# EAGLE design rbbb (EAGLE 6.4)
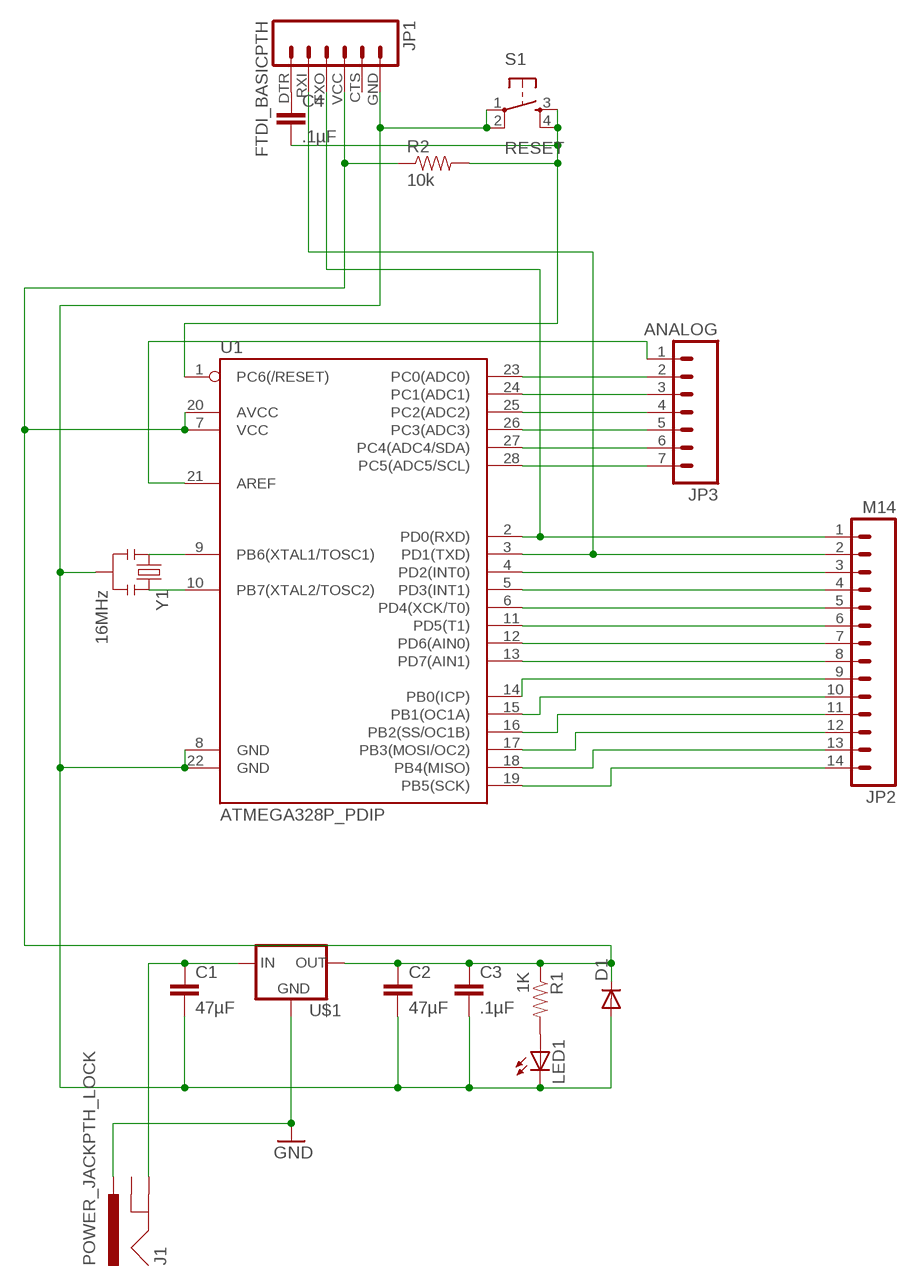
[diagram p0: schematic, sheet 1]

## Parts
C1  47µF  CAPPTH  [CAP-PTH-SMALL]
C2  47µF  CAPPTH  [CAP-PTH-SMALL]
C3  .1µF  CAPPTH  [CAP-PTH-SMALL]
C4  .1µF  CAPPTH  [CAP-PTH-SMALL]
D1  DIODEPTH  [DIODE-1N4001]
J1  POWER_JACKPTH_LOCK  [POWER_JACK_PTH_LOCK]
JP1  FTDI_BASICPTH  [FTDI_BASIC]
JP2  M14  [1X14]
JP3  ANALOG  M07  [1X07]
LED1  LED5MM  [LED5MM]
R1  1K  RESISTORPTH-1/4W  [AXIAL-0.4]
R2  10k  RESISTORPTH-1/4W  [AXIAL-0.4]
S1  RESET  TAC_SWITCHPTH  [TACTILE-PTH]
U1  ATMEGA328P_PDIP  [DIL28-3]
U$1  V_REG_78XX-TO-220  [TO-220-ALT]
Y1  16MHz  RESONATORPTH  [RESONATOR-PTH]

## Nets
GND: J1.PWR U$1.GND
N$1: U1.9(PB6(XTAL1/TOSC1)) Y1.1
N$2: U1.10(PB7(XTAL2/TOSC2)) Y1.3
N$3: LED1.A R1.P$2
N$4: C2.1 C3.1 D1.C JP1.VCC R1.P$1 R2.P$1 U1.7(VCC) U1.20(AVCC) U$1.OUT
N$5: C1.2 C2.2 C3.2 D1.A JP1.GND LED1.K(C) S1.1 S1.2 U1.8(GND) U1.22(GND) Y1.2
N$6: JP1.TXO JP2.1 U1.2(PD0(RXD))
N$7: C1.1 J1.GND U$1.IN
N$8: JP1.RXI JP2.2 U1.3(PD1(TXD))
N$9: JP2.3 U1.4(PD2(INT0))
N$10: C4.2 R2.P$2 S1.3 S1.4 U1.1(PC6(/RESET))
N$11: JP2.4 U1.5(PD3(INT1))
N$12: JP2.5 U1.6(PD4(XCK/T0))
N$13: C4.1 JP1.DTR
N$14: JP2.6 U1.11(PD5(T1))
N$15: JP2.7 U1.12(PD6(AIN0))
N$16: JP2.8 U1.13(PD7(AIN1))
N$17: JP2.9 U1.14(PB0(ICP))
N$18: JP2.10 U1.15(PB1(OC1A))
N$19: JP2.11 U1.16(PB2(SS/OC1B))
N$20: JP2.12 U1.17(PB3(MOSI/OC2))
N$21: JP2.13 U1.18(PB4(MISO))
N$22: JP2.14 U1.19(PB5(SCK))
N$23: JP3.1 U1.21(AREF)
N$24: JP3.2 U1.23(PC0(ADC0))
N$25: JP3.3 U1.24(PC1(ADC1))
N$26: JP3.4 U1.25(PC2(ADC2))
N$27: JP3.5 U1.26(PC3(ADC3))
N$28: JP3.6 U1.27(PC4(ADC4/SDA))
N$29: JP3.7 U1.28(PC5(ADC5/SCL))
Unconnected: J1.GNDBREAK JP1.CTS

## Library data of the parts
C1-C4 = SparkFun-Capacitors:CAP: Capacitor Standard 0603 ceramic capacitor, and 0.1" leaded capacitor.
D1 = SparkFun-DiscreteSemi:DIODE: Diode These are standard reverse protection diodes and small signal diodes. SMA package can handle up to about 1A. SOD-323 can handle about 200mA. What the SOD-323 package when ordering, there are some mfgs out there that are 5-pin packages.
J1 = SparkFun-Connectors:POWER_JACK: Power Jack This is the standard 5.5mm barrel jack for power. The PTH is the most common, proven, reliable, footprint. The Slot footprint only works if the mill layer is transmitted to the PCB fab house so be warned. Spark Fun Electronics SKU : PRT-00119 SMT: CONN-08106 Mating wall wart : TOL-00298 (and others)
JP1 = SparkFun-Connectors:FTDI_BASIC: FTDI Basic header with labels
JP2 = SparkFun-Connectors:M14: Header 14 Standard 14-pin 0.1" header. Use with straight break away headers (SKU : PRT-00116), right angle break away headers (PRT-00553), swiss pins (PRT-00743), machine pins (PRT-00117), and female headers (PRT-00115).
JP3 = SparkFun-Connectors:M07: Header 7 Standard 7-pin 0.1" header. Use with straight break away headers (SKU : PRT-00116), right angle break away headers (PRT-00553), swiss pins (PRT-00743), machine pins (PRT-00117), and female headers (PRT-00115). NOTES ON THE VARIANTS LOCK and LOCK_LONGPADS... This footprint was designed to help hold the alignment of a through-hole component (i.e. 7-pin header) while soldering it into place. You may notice that each hole has been shifted either up or down by 0.005 of an inch from it's more standard position (which is usually a perfectly straight line). This slight alteration caused the pins (the squares in the middle) to touch the edges of the holes. Because they are alternating, it causes a "brace" to hold the header in place. 0.005 has proven to be the perfect amount of "off-center" position when using our standard breakaway headers. Although looks a little odd when you look at the bare footprint, once you have a header in there, the alteration is very hard to notice. Also, if you push a header all the way into place, it is covered up entirely on the bottom side. This idea of altering the position of holes to aid alignment will be further integrated into the Sparkfun Library for other footprints. It can help hold any component with 3 or more connection pins.
LED1 = led:LED: LED OSRAM: - CHIPLED LG R971, LG N971, LY N971, LG Q971, LY Q971, LO R971, LY R971 LH N974, LH R974 LS Q976, LO Q976, LY Q976 LO Q996 - Hyper CHIPLED LW Q18S LB Q993, LB Q99A, LB R99A - SideLED LS A670, LO A670, LY A670, LG A670, LP A670 LB A673, LV A673, LT A673, LW A673 LH A674 LY A675 LS A676, LA A676, LO A676, LY A676, LW A676 LS A679, LY A679, LG A679 - Hyper Micro SIDELED® LS Y876, LA Y876, LO Y876, LY Y876 LT Y87S - SmartLED LW L88C, LW L88S LB L89C, LB L89S, LG L890 LS L89K, LO L89K, LY L89K LS L896, LA L896, LO L896, LY L896 - TOPLED LS T670, LO T670, LY T670, LG T670, LP T670 LSG T670, LSP T670, LSY T670, LOP T670, LYG T670 LG T671, LOG T671, LSG T671 LB T673, LV T673, LT T673, LW T673 LH T674 LS T676, LA T676, LO T676, LY T676, LB T676, LH T676, LSB T676, LW T676 LB T67C, LV T67C, LT T67C, LS T67K, LO T67K, LY T67K, LW E67C LS E67B, LA E67B, LO E67B, LY E67B, LB E67C, LV E67C, LT E67C LW T67C LS T679, LY T679, LG T679 LS T770, LO T770, LY T770, LG T770, LP T770 LB T773, LV T773, LT T773, LW T773 LH T774 LS E675, LA E675, LY E675, LS T675 LS T776, LA T776, LO T776, LY T776, LB T776 LHGB T686 LT T68C, LB T68C - Hyper Mini TOPLED® LB M676 - Mini TOPLED Santana® LG M470 LS M47K, LO M47K, LY M47K Source: http://www.osram.convergy.de LUXEON: - LUMILED® LXK2-PW12-R00, LXK2-PW12-S00, LXK2-PW14-U00, LXK2-PW14-V00 LXK2-PM12-R00, LXK2-PM12-S00, LXK2-PM14-U00 LXK2-PE12-Q00, LXK2-PE12-R00, LXK2-PE12-S00, LXK2-PE14-T00, LXK2-PE14-U00 LXK2-PB12-K00, LXK2-PB12-L00, LXK2-PB12-M00, LXK2-PB14-N00, LXK2-PB14-P00, LXK2-PB14-Q00 LXK2-PR12-L00, LXK2-PR12-M00, LXK2-PR14-Q00, LXK2-PR14-R00 LXK2-PD12-Q00, LXK2-PD12-R00, LXK2-PD12-S00 LXK2-PH12-R00, LXK2-PH12-S00 LXK2-PL12-P00, LXK2-PL12-Q00, LXK2-PL12-R00 Source: www.luxeon.com KINGBRIGHT: KA-3528ASYC Source: www.kingbright.com
R1 R2 = SparkFun-Resistors:RESISTOR: Resistor Basic schematic elements and footprints for 0603, 1206, and PTH resistors.
S1 = SparkFun-Electromechanical:TAC_SWITCH: Momentary Switch Button commonly used for reset or general input. Spark Fun Electronics SKU : COM-00097 SMT- SWCH-08247
U1 = SparkFun-DigitalIC:ATMEGA328P_PDIP: uC used in the Arduino 32kb flash, 1k EEPROM, 2k SRAM This is the through-hole version of this chip.
U$1 = SparkFun-PowerIC:V_REG_78XX: Voltage Regulator Standard 7805 5V regulator. IGO (Input Ground Output). Spark Fun Electronics SKU : COM-00107
Y1 = SparkFun-FreqCtrl:RESONATOR: Resonator Small SMD resonator. Used, eg, on the Arduino Pro/ Pro Mini boards. 8MHz- XTAL-08895 16MHz- XTAL-08900

## Board
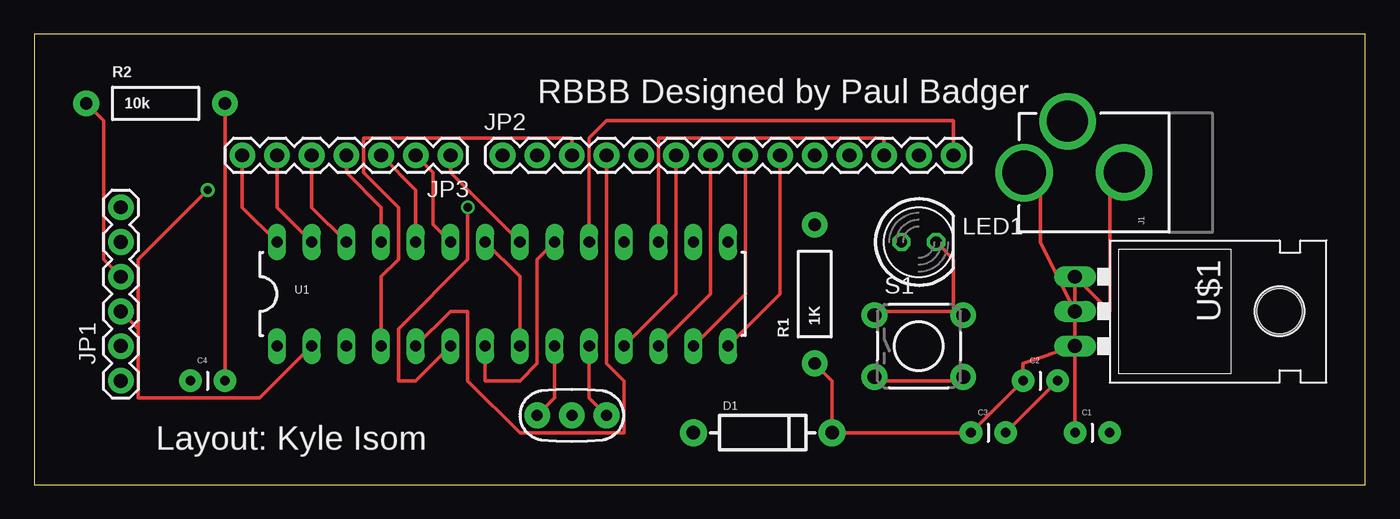
[diagram p1: board, top side]
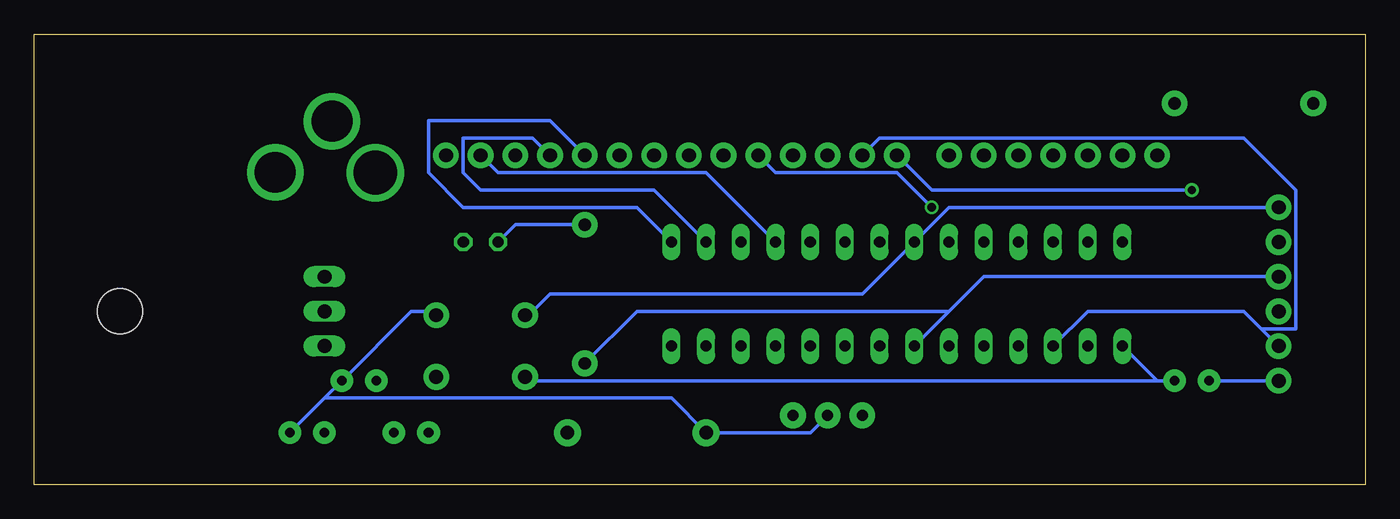
[diagram p2: board, bottom side, seen from below]

Size 97.46 x 33.01 mm. Coordinates in mm from the lower left corner, seen from the top.
Outline: 0,0 97.46,0 97.46,33.01 0,33.01 0,0
Copper layers (1*16): Top 0.035mm / dielectric 1.5mm / Bottom 0.035mm
Design rules "default": minimum track width 10mil, minimum drill 24mil, track to track 8mil, track to pad 8mil, pad to pad 8mil, via to via 8mil, smd to smd 8mil, copper to edge 40mil, drill to drill 8mil, minimum pad ring 10mil, minimum via ring 8mil, stop-mask expansion 4mil, vias tented up to drill 0mil, thermal gap 10mil

### Footprints (pad centres in the part's own frame; a part is rotated, then mirrored left to right if it is on the bottom)
CAP-PTH-SMALL = drill 0.7 pad 1.651: 1 0,0; 2 2.54,0
DIODE-1N4001 = drill 1 pad 1.981: A -5.08,0; C 5.08,0
POWER_JACK_PTH_LOCK = drill 2.997 pad 4.115: GND 0.025,6.557; GNDBREAK 3.762,10.7 | drill 3.2 pad 4.115: PWR 0,13.878
FTDI_BASIC = drill 1.016 pad 1.88: CTS 10.16,0; DTR 0,0; GND 12.7,0; RXI 2.54,0; TXO 5.08,0; VCC 7.62,0
1X14 = drill 1.016 pad 1.88: 1 0,0; 2 2.54,0; 3 5.08,0; 4 7.62,0; 5 10.16,0; 6 12.7,0; 7 15.24,0; 8 17.78,0; 9 20.32,0; 10 22.86,0; 11 25.4,0; 12 27.94,0; 13 30.48,0; 14 33.02,0
1X07 = drill 1.016 pad 1.88: 1 0,0; 2 2.54,0; 3 5.08,0; 4 7.62,0; 5 10.16,0; 6 12.7,0; 7 15.24,0
LED5MM = drill 0.813 octagon: A -1.27,0; K 1.27,0
AXIAL-0.4 = drill 0.9 pad 1.88: P$1 -5.08,0; P$2 5.08,0
TACTILE-PTH = drill 1.016 pad 1.88: 1 -3.251,2.261; 2 3.251,2.261; 3 -3.251,-2.261; 4 3.251,-2.261
DIL28-3 = drill 0.813 long: 1 -16.51,-3.81; 2 -13.97,-3.81; 3 -11.43,-3.81; 4 -8.89,-3.81; 5 -6.35,-3.81; 6 -3.81,-3.81; 7 -1.27,-3.81; 8 1.27,-3.81; 9 3.81,-3.81; 10 6.35,-3.81; 11 8.89,-3.81; 12 11.43,-3.81; 13 13.97,-3.81; 14 16.51,-3.81; 15 16.51,3.81; 16 13.97,3.81; 17 11.43,3.81; 18 8.89,3.81; 19 6.35,3.81; 20 3.81,3.81; 21 1.27,3.81; 22 -1.27,3.81; 23 -3.81,3.81; 24 -6.35,3.81; 25 -8.89,3.81; 26 -11.43,3.81; 27 -13.97,3.81; 28 -16.51,3.81
TO-220-ALT = drill 1.016 long: GND 0,-3.81; IN -2.54,-3.81; OUT 2.54,-3.81 | hole 3.302: 0,11.176
RESONATOR-PTH = drill 0.8 pad 1.88: 1 -2.54,0; 2 0,0; 3 2.54,0

### Placement (x,y rotation side)
C1  76.2,3.81 0 top
C2  72.39,7.62 0 top
C3  68.58,3.81 0 top
C4  11.43,7.62 0 top
D1  53.34,3.81 0 top
J1  86.36,22.86 90 top
JP1  6.35,7.62 90 top
JP2  34.29,24.13 0 top
JP3  30.48,24.13 180 top
LED1  64.77,17.78 0 top
R1  57.15,13.97 90 top
R2  8.89,27.94 0 top
S1  64.77,10.16 0 top
U1  34.29,13.97 0 top
U$1  80.01,12.7 270 top
Y1  39.37,5.08 0 top

### Tracks (layer width: path | path; a pad name or v marks a point on that pad's centre or on a via)
GND
  Top 0.254: U$1.GND 73.66,17.78 73.66,22.86 J1.PWR
N$1
  Top 0.254: U1.9 38.1,6.35 Y1.1
N$2
  Top 0.254: U1.10 40.64,6.35 Y1.3
N$3
  Bottom 0.254: LED1.A 62.23,19.05 R1.P$2
N$4
  Top 0.254: R1.P$1 58.42,7.62 D1.C C3.1 C2.1 72.39,8.89 U$1.OUT | U1.20 36.83,16.51 36.83,8.89 35.56,7.62 33.02,7.62 U1.7 | R2.P$1 5.08,26.67 5.08,16.51 JP1.VCC
  Bottom 0.254: 30.48,12.7 27.94,15.24 JP1.VCC | 30.48,12.7 U1.7 | R1.P$1 53.34,12.7 30.48,12.7
N$5
  Top 0.254: U1.22 35.56,15.24 U1.8 | C2.2 C3.2 | LED1.K 67.31,16.51 67.31,12.7 | 67.31,12.7 62.23,12.7 S1.1 | 67.31,12.7 S1.2
  Bottom 0.254: JP1.GND 30.48,20.32 U1.22 36.83,13.97 59.69,13.97 60.96,12.7 S1.1 | Y1.2 40.64,3.81 D1.A 50.8,6.35 76.2,6.35 | 76.2,6.35 C2.2 69.85,12.7 68.58,12.7 S1.2 | 76.2,6.35 C1.2
N$6  (via drill 0.61)
  Top 0.254: U1.2 16.51,6.35 7.62,6.35 7.62,11.43 | JP1.TXO 7.62,11.43 | v12.7,21.59 7.62,16.51 7.62,11.43
  Bottom 0.254: JP2.1 31.75,21.59 v12.7,21.59
N$7
  Top 0.254: C1.1 U$1.IN 78.74,12.7 78.74,22.86 J1.GND
N$8
  Bottom 0.254: U1.3 20.32,12.7 8.89,12.7 7.62,11.43 | JP1.RXI 7.62,11.43 | JP2.2 35.56,25.4 8.89,25.4 5.08,21.59 5.08,11.43 7.62,11.43
N$9
  Top 0.254: U1.4 25.4,15.24 26.67,16.51 26.67,20.32 24.13,22.86 24.13,25.4 39.37,25.4 JP2.3
N$10
  Top 0.254: S1.3 62.23,7.62 67.31,7.62 S1.4 | C4.2 R2.P$2
  Bottom 0.254: 15.24,7.62 U1.1 | C4.2 15.24,7.62 | 15.24,7.62 60.96,7.62 S1.3
N$11
  Top 0.254: U1.5 30.48,12.7 31.75,12.7 31.75,7.62 35.56,3.81 43.18,3.81 43.18,7.62 41.91,8.89 JP2.4
N$12  (via drill 0.61)
  Top 0.254: U1.6 27.94,7.62 26.67,7.62 26.67,11.43 31.75,16.51 v31.75,20.32
  Bottom 0.254: v31.75,20.32 34.29,22.86 43.18,22.86 JP2.5
N$13
  Bottom 0.254: JP1.DTR C4.1
N$14
  Top 0.254: U1.11 46.99,13.97 JP2.6
N$15
  Top 0.254: U1.12 49.53,13.97 JP2.7
N$16
  Top 0.254: U1.13 52.07,13.97 JP2.8
N$17
  Top 0.254: U1.14 54.61,13.97 JP2.9
N$18
  Bottom 0.254: U1.15 53.34,20.32 66.04,20.32 68.58,22.86 68.58,26.67 59.69,26.67 JP2.10
N$19
  Bottom 0.254: U1.16 52.07,21.59 64.77,21.59 66.04,22.86 66.04,25.4 60.96,25.4 JP2.11
N$20
  Top 0.254: U1.17 45.72,25.4 62.23,25.4 JP2.12
N$21
  Bottom 0.254: U1.18 48.26,22.86 63.5,22.86 JP2.13
N$22
  Top 0.254: U1.19 40.64,25.4 41.91,26.67 67.31,26.67 JP2.14
N$23
  Top 0.254: U1.21 30.48,22.86 JP3.1
N$24
  Top 0.254: U1.23 29.21,19.05 29.21,22.86 JP3.2
N$25
  Top 0.254: U1.24 27.94,21.59 JP3.3
N$26
  Top 0.254: U1.25 25.4,20.32 22.86,22.86 JP3.4
N$27
  Top 0.254: U1.26 20.32,20.32 JP3.5
N$28
  Top 0.254: U1.27 17.78,20.32 JP3.6
N$29
  Top 0.254: U1.28 15.24,20.32 JP3.7

### Text on the board
tPlace: RBBB Designed by Paul Badger | Layout: Kyle Isom